# Altium project STM32WB55开发板.PrjPcb
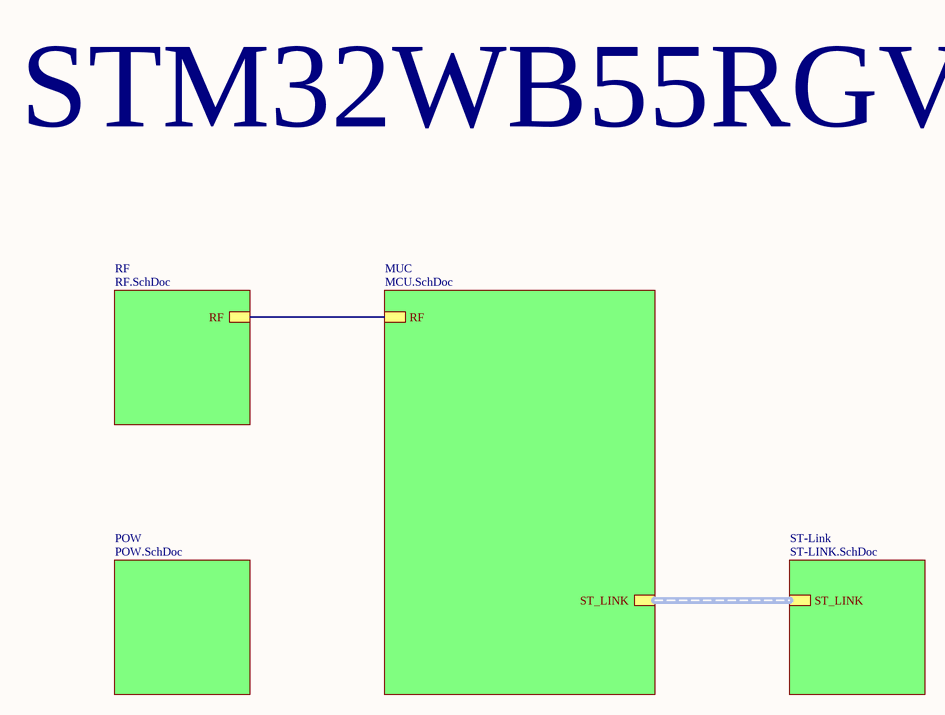
[diagram p0: WB55_Schematic.SchDoc]
5 sheets, 103 parts. Net scope: hierarchical (ports join the sheet entries above them; power ports are global).
Board file: PCB1.PcbDoc
Sheets:
  WB55_Schematic.SchDoc
    POW = POW.SchDoc
    MUC = MCU.SchDoc
    RF = RF.SchDoc
    ST-Link = ST-LINK.SchDoc

## Sheet WB55_Schematic.SchDoc
size A4; SheetNumber: 1; SheetTotal: 5

### Sub-sheets
MUC = MCU.SchDoc: RF, ST_LINK
POW = POW.SchDoc: no entries
RF = RF.SchDoc: RF
ST-Link = ST-LINK.SchDoc: ST_LINK

### Nets
RF1: sheet MUC/RF, sheet RF/RF

### Buses and harness runs
harness sheet MUC/ST_LINK = sheet ST-Link/ST_LINK

### Notes on the sheet
- STM32WB55RGV6

## Sheet POW.SchDoc
size A4; SheetNumber: 2; SheetTotal: 5
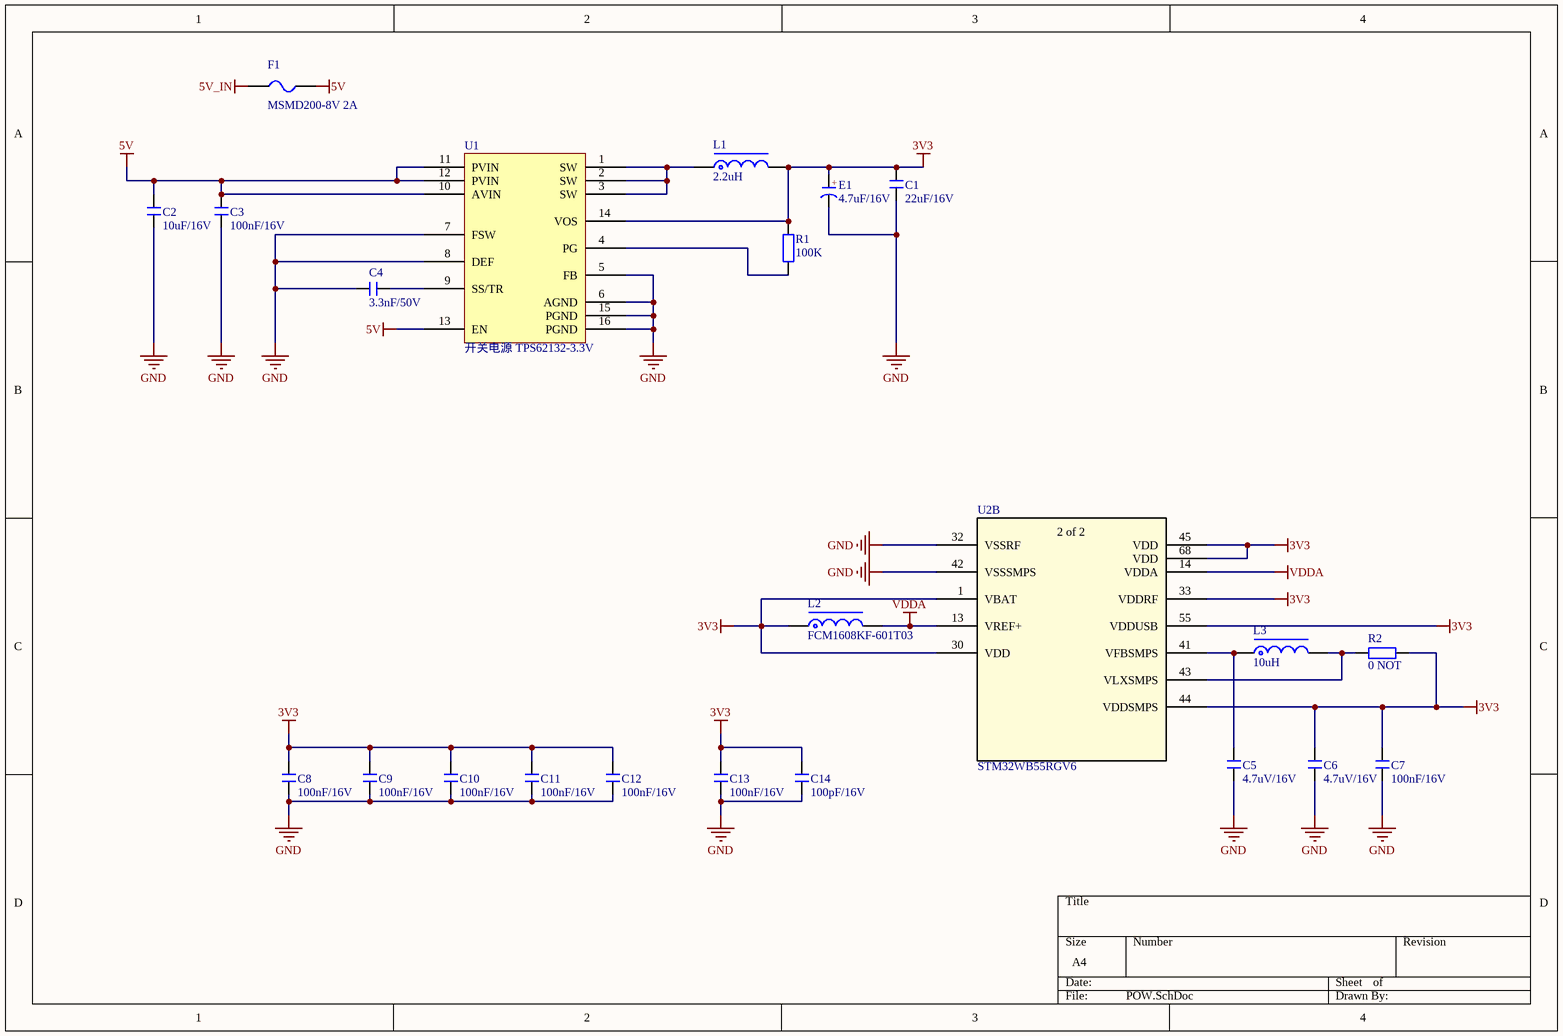
[diagram p1: POW.SchDoc]

### Parts
C1  22uF/16V  [C 0805_L]
C2  10uF/16V  [C 0603_L]
C3  100nF/16V  [C 0402_L]
C4  3.3nF/50V  [C 0402_L]
C5  4.7uV/16V  [C 0603_L]
C6  4.7uV/16V  [C 0603_L]
C7  100nF/16V  [C 0402_L]
C8  100nF/16V  [C 0402_L]
C9  100nF/16V  [C 0402_L]
C10  100nF/16V  [C 0402_L]
C11  100nF/16V  [C 0402_L]
C12  100nF/16V  [C 0402_L]
C13  100nF/16V  [C 0402_L]
C14  100pF/16V  [C 0402_L]
E1  4.7uF/16V  [CD A(3216)]
F1  MSMD200-8V 2A  [FU 0603]
L1  2.2uH  [电感XFL4020]
L2  FCM1608KF-601T03  [L 0402]
L3  10uH  [L 0805]
R1  100K  [R 0402_L]
R2  0 NOT  [R 0603_L]
U1  开关电源 TPS62132-3.3V  [QFN16]
U2  STM32WB55RGV6  [VFQFN68-8x8mm-M]  (part B of 2)

### Nets
3V3: C1.1 C6.2 C7.2 C8.2 C9.2 C10.2 C11.2 C12.2 C13.2 C14.2 E1.1(A) L1.2 L2.1 R1.2 R2.1 U1.14(VOS) U2.1(VBAT) U2.30(VDD) U2.33(VDDRF) U2.44(VDDSMPS) U2.45(VDD) U2.55(VDDUSB) U2.68(VDD)
5V: C2.2 C3.2 F1.2 U1.10(AVIN) U1.11(PVIN) U1.12(PVIN) U1.13(EN)
5V_IN: F1.1
GND: C1.2 C2.1 C3.1 C4.1 C5.1 C6.1 C7.1 C8.1 C9.1 C10.1 C11.1 C12.1 C13.1 C14.1 E1.2(K) U1.5(FB) U1.6(AGND) U1.7(FSW) U1.8(DEF) U1.15(PGND) U1.16(PGND) U2.32(VSSRF) U2.42(VSSSMPS)
VDDA: L2.2 U2.13(VREF+) U2.14(VDDA)
NetC4_2: C4.2 U1.9(SS/TR)
NetC5_2: C5.2 L3.1 U2.41(VFBSMPS)
NetL1_1: L1.1 U1.1(SW) U1.2(SW) U1.3(SW)
NetL3_2: L3.2 R2.2 U2.43(VLXSMPS)
NetR1_1: R1.1 U1.4(PG)

### Notes on the sheet
- (in symbol C-CD) +
- (in symbol STM32WB55RGV6, part B) 2 of 2

### Library data of the parts
C1 = C: 贴片电容; 主类型: 电容; 值精度: ±10%; 元件封装: 0805; 具体类型: 陶瓷电容; 封装类型: 贴片; 温度漂移: X7R（10%）; 温度范围: -55°C ~ 125°C; 生产商: SAMSUNG(三星); 生产商零件编码: CL21A226KOQNNNE; 值/型号: 22uF/16V; 立创编号: C296720
C2 = C: 贴片电容; 主类型: 电容; 值精度: ±10%; 元件封装: 0603; 具体类型: 陶瓷电容; 封装类型: 贴片; 温度漂移: X5R; 温度范围: -55°C ~ 125°C; 生产商: SAMSUNG(三星); 生产商零件编码: CL10A106MO8NQNC; 值/型号: 10uF/16V; 立创编号: C92487C70462
C3 C7-C13 = C: 贴片电容; 主类型: 电容; 值精度: ±10%; 元件封装: 0402; 具体类型: 陶瓷电容; 封装类型: 贴片; 温度漂移: X7R（15%）; 温度范围: -55°C ~ 125°C; 生产商: YAGEO(国巨); 生产商零件编码: CC0402KRX7R7BB104; 值/型号: 100nF/16V; 立创编号: C60474
C4 = C: 贴片电容; 主类型: 电容; 值精度: ±5%; 元件封装: 0402; 具体类型: 陶瓷电容; 封装类型: 贴片; 温度漂移: X7R（5%）; 温度范围: -55°C ~ 125°C; 生产商: YAGEO(国巨); 生产商零件编码: CC0402JRX7R9BB332; 值/型号: 3.3nF/50V; 立创编号: C541447
C5 C6 = C: 贴片电容; 主类型: 电容; 值/型号: 4.7uF/16V; 值精度: ±10%; 元件封装: 0603; 具体类型: 陶瓷电容; 封装类型: 贴片; 温度漂移: X5R（10%）; 温度范围: -55°C ~ 125°C; 生产商: muRata(村田); 生产商零件编码: GRM188R61C475KE11D; 立创编号: C77045
C14 = C: 贴片电容; 主类型: 电容; 值精度: ±5%; 元件封装: 0402; 具体类型: 陶瓷电容; 封装类型: 贴片; 温度漂移: NP0（5%）; 温度范围: -55°C ~ 125°C; 生产商: YAGEO(国巨); 生产商零件编码: CC0402JRNPO7BN101; 值/型号: 100pF/16V; 立创编号: C526991
E1 = C-CD: 聚合物电容 4.7uF/16V; 主类型: 电容; 值精度: ±20%; 元件封装: CASE-A_3216; 封装类型: 贴片; 温度范围: -55℃ ~ +105℃; 生产商: Sunlord(顺络); 生产商零件编码: TC211A475M016A; 值/型号: 4.7uF/16V; 具体类型: 聚合物电容; 立创编号: C136628
F1 = FU: 贴片保险丝
L1 = L-CD: XFL4020-222MEB; 主类型: 电感; 元件封装: 4020; 具体类型: 功率电感; 封装类型: 贴片; 温度范围: -40-125; 生产商: Coilcraft; 类型备注: 淘宝采购; 值/型号: XFL4020-222MEB; 生产商零件编码: XFL4020-222MEB; 立创编号: https://detail.tmall.com/item.htm?spm=a230r.1.14.16.717a6f292tX0SR&id=619184428761&ns=1&abbucket=12
L2 = L-CD: 0805; 主类型: 电感; 元件封装: 0603; 具体类型: 功率电感; 封装类型: 贴片; 温度范围: -40-125; 生产商: 台庆; 值/型号: FCM1608KF-601T03; 生产商零件编码: FCM1608KF-601T03; 立创编号: C141723
L3 = L-CD: 74479777310A; 主类型: 电感; 元件封装: 0805; 具体类型: 功率电感; 封装类型: 贴片; 温度范围: -40-125; 生产商: WE; 类型备注: 淘宝采购; 值/型号: 74479777310A; 生产商零件编码: 74479777310A
R1 = R: 贴片电阻 0402 1%; 主类型: 电阻; 元件封装: 0402; 封装类型: 贴片; 温度漂移: ±100ppm/℃; 生产商: 国巨; 生产商零件编码: RC0402FR-07100KL; 值/型号: 100K; 值精度: ±1%; 具体类型: 贴片电阻; 立创编号: C60491
R2 = R: 贴片电阻 0402 1%; 主类型: 电阻; 值/型号: 0; 值精度: ±5%; 元件封装: 0603; 封装类型: 贴片; 温度漂移: -200ppm/℃~400ppm/℃; 生产商: 华新科(Walsin); 生产商零件编码: WR06X000PTL; 具体类型: 贴片电阻; 立创编号: C132607
U1 = 开关电源 TPS62133: 主类型: 线性稳压器; 值/型号: TPS62133RGTR; 元件封装: VQFN-16; 具体类型: LDO; 封装类型: 贴片; 温度范围: -40-85; 生产商: TI(德州仪器); 生产商零件编码: TPS62133RGTR; 立创编号: C73973
U2 = STM32WB55RGV6: No Description Available; Vendor: STMicroelectronics; Built_By: EMA_UL_Team; SourceLibrary: Updates_to_database_2020-10-19; Manufacturer_Part_Number: STM32WB55RGV6; Copyright: Copyright (C) 2018 Accelerated Designs. All rights reserved; RefDes: RefDes; Type: DEV

## Sheet MCU.SchDoc
size A3; SheetNumber: 3; SheetTotal: 5
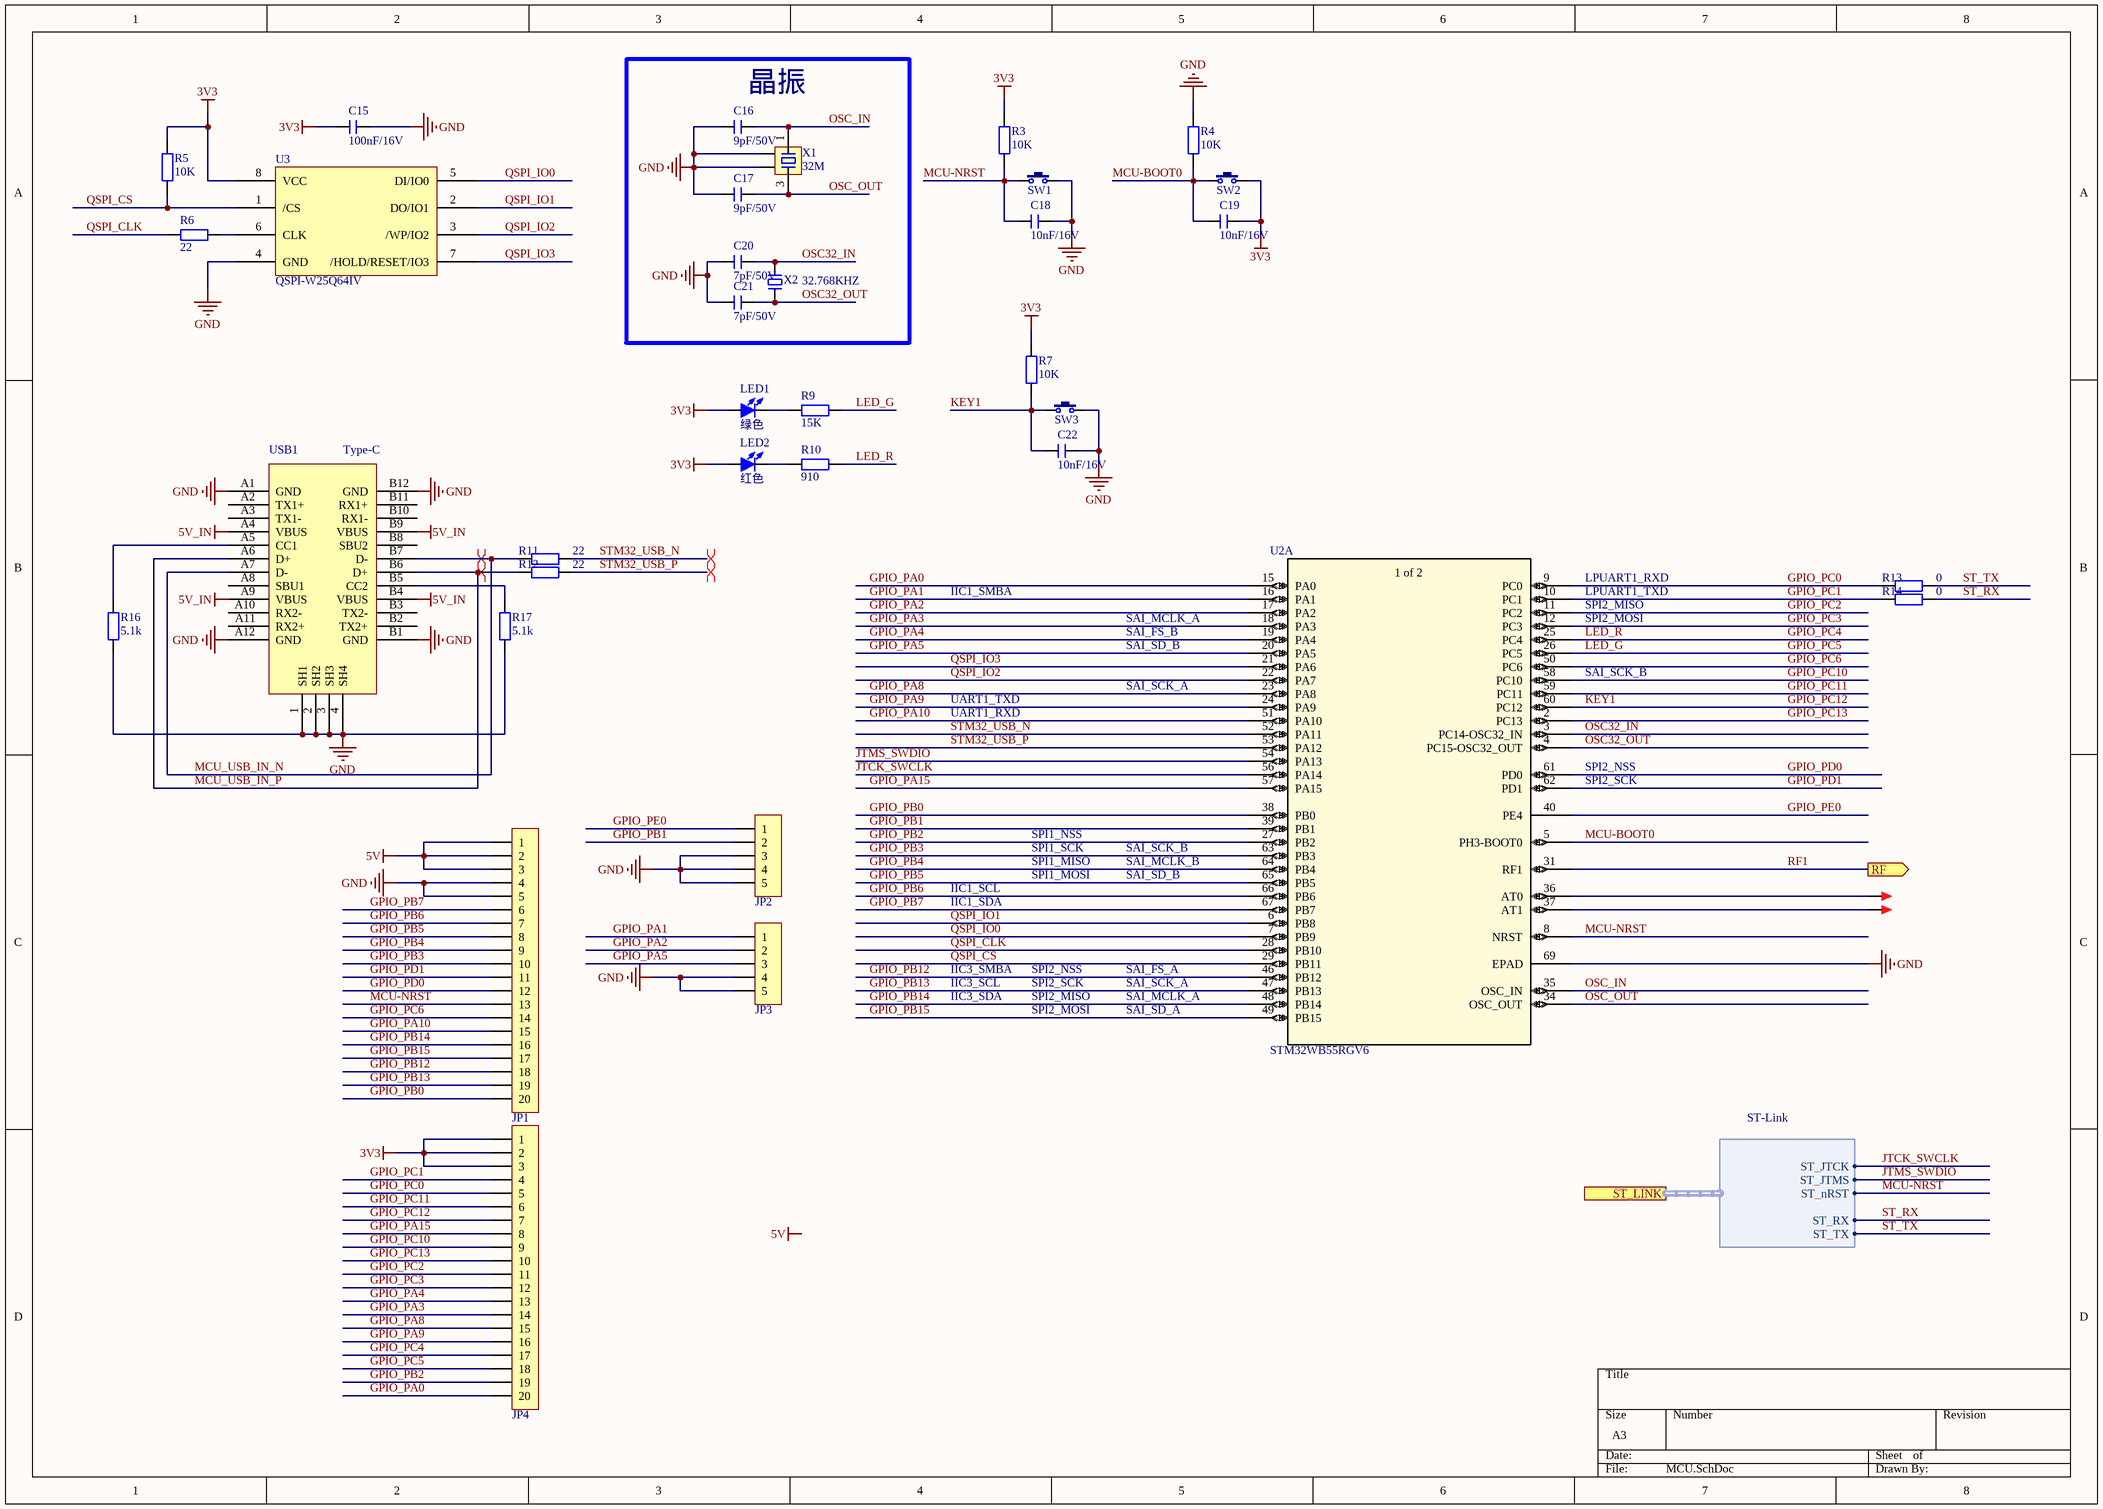
[diagram p2: MCU.SchDoc]

### Parts
C15  100nF/16V  [C 0402_L]
C16  9pF/50V  [C 0402_L]
C17  9pF/50V  [C 0402_L]
C18  10nF/16V  [C 0402_L]
C19  10nF/16V  [C 0402_L]
C20  7pF/50V  [C 0402_L]
C21  7pF/50V  [C 0402_L]
C22  10nF/16V  [C 0402_L]
JP1  HDR-1X20  [HDR2.54-LI-20P]  (value not drawn)
JP2  HDR-1X5  [HDR2.54-LI-5P]  (value not drawn)
JP3  HDR-1X5  [HDR2.54-LI-5P]  (value not drawn)
JP4  HDR-1X20  [HDR2.54-LI-20P]  (value not drawn)
LED1  绿色  [LED]
LED2  红色  [LED]
R3  10K  [R 0402_L]
R4  10K  [R 0402_L]
R5  10K  [R 0402_L]
R6  22  [R 0402_L]
R7  10K  [R 0402_L]
R9  15K  [R 0402_L]
R10  910  [R 0402_L]
R11  22  [R 0402_L]
R12  22  [R 0402_L]
R13  0  [R 0402_L]
R14  0  [R 0402_L]
R16  5.1k  [R 0402_L]
R17  5.1k  [R 0402_L]
SW1  3x6x5  [按钮]  (value not drawn)
SW2  3x6x5  [按钮]  (value not drawn)
SW3  3x6x5  [按钮]  (value not drawn)
TP1  TEST  [TEST 1.2]  (value not drawn)
TP2  TEST  [TEST 1.2]  (value not drawn)
U2  STM32WB55RGV6  [VFQFN68-8x8mm-M]  (part A of 2)
U3  QSPI-W25Q64IV  [QSPI]
USB1  Type-C  [Type-c接口]
X1  32M  [OSC 1612-4P]
X2  32.768KHZ  [OSC 3215-2P]

### Blocks framed on the sheet
晶振: C16 C17 C20 C21 X1 X2

### Ports
RF (out), ST_LINK (harness ST-Link)

### Harnesses
ST-Link: ST_JTCK, ST_JTMS, ST_nRST, ST_RX, ST_TX

### Nets
3V3: C15.2 C19.2 JP4.1 JP4.2 JP4.3 LED1.1(A) LED2.1(A) R3.2 R5.1 R7.2 SW2.2 U3.8(VCC)
5V: JP1.1 JP1.2 JP1.3
5V_IN: USB1.A4(VBUS) USB1.A9(VBUS) USB1.B4(VBUS) USB1.B9(VBUS)
GND: C15.1 C16.1 C17.1 C18.2 C20.1 C21.1 C22.2 JP1.4 JP1.5 JP2.3 JP2.4 JP2.5 JP3.4 JP3.5 R4.2 R16.2 R17.2 SW1.2 SW3.2 U2.69(EPAD) U3.4(GND) USB1.1(SH1) USB1.2(SH2) USB1.3(SH3) USB1.4(SH4) USB1.A1(GND) USB1.A12(GND) USB1.B1(GND) USB1.B12(GND) X1.2 X1.4
GPIO_PA0: JP4.20 U2.15(PA0)
GPIO_PA1: JP3.1 U2.16(PA1)
GPIO_PA2: JP3.2 U2.17(PA2)
GPIO_PA3: JP4.14 U2.18(PA3)
GPIO_PA4: JP4.13 U2.19(PA4)
GPIO_PA5: JP3.3 U2.20(PA5)
GPIO_PA8: JP4.15 U2.23(PA8)
GPIO_PA9: JP4.16 U2.24(PA9)
GPIO_PA10: JP1.15 U2.51(PA10)
GPIO_PA15: JP4.8 U2.57(PA15)
GPIO_PB0: JP1.20 U2.38(PB0)
GPIO_PB1: JP2.2 U2.39(PB1)
GPIO_PB2: JP4.19 U2.27(PB2)
GPIO_PB3: JP1.10 U2.63(PB3)
GPIO_PB4: JP1.9 U2.64(PB4)
GPIO_PB5: JP1.8 U2.65(PB5)
GPIO_PB6: JP1.7 U2.66(PB6)
GPIO_PB7: JP1.6 U2.67(PB7)
GPIO_PB12: JP1.18 U2.46(PB12)
GPIO_PB13: JP1.19 U2.47(PB13)
GPIO_PB14: JP1.16 U2.48(PB14)
GPIO_PB15: JP1.17 U2.49(PB15)
GPIO_PC0: JP4.5 R13.2 U2.9(PC0)
GPIO_PC1: JP4.4 R14.2 U2.10(PC1)
GPIO_PC2: JP4.11 U2.11(PC2)
GPIO_PC3: JP4.12 U2.12(PC3)
GPIO_PC4: JP4.17 R10.1 U2.25(PC4)  [also labelled LED_R]
GPIO_PC5: JP4.18 R9.1 U2.26(PC5)  [also labelled LED_G]
GPIO_PC6: JP1.14 U2.50(PC6)
GPIO_PC10: JP4.9 U2.58(PC10)
GPIO_PC11: JP4.6 U2.59(PC11)
GPIO_PC12: C22.1 JP4.7 R7.1 SW3.1 U2.60(PC12)  [also labelled KEY1]
GPIO_PC13: JP4.10 U2.2(PC13)
GPIO_PD0: JP1.12 U2.61(PD0)
GPIO_PD1: JP1.11 U2.62(PD1)
GPIO_PE0: JP2.1 U2.40(PE4)
JTCK_SWCLK: U2.56(PA14) ; port ST_LINK.ST_JTCK  [project net JTCK]
JTMS_SWDIO: U2.54(PA13) ; port ST_LINK.ST_JTMS  [project net JTMS]
MCU-BOOT0: C19.1 R4.1 SW2.1 U2.5(PH3-BOOT0)
MCU-NRST: C18.1 JP1.13 R3.1 SW1.1 U2.8(NRST) ; port ST_LINK.ST_nRST
MCU_USB_IN_N: R11.2 USB1.A7(D-) USB1.B7(D-)
MCU_USB_IN_P: R12.2 USB1.A6(D+) USB1.B6(D+)
OSC32_IN: C20.2 U2.3(PC14-OSC32_IN) X2.2
OSC32_OUT: C21.2 U2.4(PC15-OSC32_OUT) X2.1
OSC_IN: C16.2 U2.35(OSC_IN) X1.1
OSC_OUT: C17.2 U2.34(OSC_OUT) X1.3
QSPI_CLK: R6.1 U2.28(PB10)
QSPI_CS: R5.2 U2.29(PB11) U3.1(/CS)
QSPI_IO0: U2.7(PB9) U3.5(DI/IO0)
QSPI_IO1: U2.6(PB8) U3.2(DO/IO1)
QSPI_IO2: U2.22(PA7) U3.3(/WP/IO2)
QSPI_IO3: U2.21(PA6) U3.7(/HOLD/RESET/IO3)
RF1: U2.31(RF1) ; port RF
ST_RX: R14.1 ; port ST_LINK.ST_RX
ST_TX: R13.1 ; port ST_LINK.ST_TX
STM32_USB_N: R11.1 U2.52(PA11)
STM32_USB_P: R12.1 U2.53(PA12)
NetLED1_2: LED1.2(K) R9.2
NetLED2_2: LED2.2(K) R10.2
NetR6_2: R6.2 U3.6(CLK)
NetR16_1: R16.1 USB1.A5(CC1)
NetR17_1: R17.1 USB1.B5(CC2)
NetTP1_1: TP1.1 U2.36(AT0)
NetTP2_1: TP2.1 U2.37(AT1)

Not connected (* = marked no-connect by the designer): USB1 A2(TX1+) A3(TX1-) A8(SBU1) A10(RX2-) A11(RX2+) B2(TX2+) B3(TX2-) B8(SBU2) B10(RX1-) B11(RX1+)

### Layout directives
differential pair: MCU_USB_IN_N, MCU_USB_IN_P, STM32_USB_N, STM32_USB_P

### Notes on the sheet
- LPUART1_RXD
- IIC1_SMBA
- SAI_FS_B
- SAI_SD_B
- SAI_MCLK_A
- LPUART1_TXD
- SPI2_MISO
- SPI2_MOSI
- UART1_TXD
- UART1_RXD
- SAI_SCK_A
- SAI_SCK_B
- SPI2_NSS
- SPI2_SCK
- SPI1_NSS
- SPI1_SCK
- IIC1_SCL
- IIC1_SDA
- SPI1_MISO
- SPI1_MOSI
- SAI_MCLK_B
- IIC3_SMBA
- IIC3_SCL
- SAI_FS_A
- IIC3_SDA
- SAI_SD_A
- Labels drawn without touching a wire or pin: 5V
- (in symbol STM32WB55RGV6, part A) 1 of 2

### Library data of the parts
C15 = C: as C3 on sheet POW; 值/型号: 100nF/16V; 立创编号: C60474
C16 C17 = C: 贴片电容; 主类型: 电容; 值/型号: 10pF/50V; 值精度: ±1%; 元件封装: 0402; 具体类型: 陶瓷电容; 封装类型: 贴片; 温度漂移: C0G; 生产商: FH(风华); 生产商零件编码: 0402CG100F500NT; 立创编号: C285132
C18 C19 C22 = C: 贴片电容; 主类型: 电容; 值精度: ±10%; 元件封装: 0402; 具体类型: 陶瓷电容; 封装类型: 贴片; 温度漂移: X7R; 生产商: YAGEO(国巨); 生产商零件编码: CC0402KRX7R7BB103; 值/型号: 10nF/16V; 立创编号: C327009
C20 C21 = C: 贴片电容; 主类型: 电容; 值精度: ±0.25pF; 元件封装: 0402; 具体类型: 陶瓷电容; 封装类型: 贴片; 温度漂移: C0G; 生产商: FH(风华); 生产商零件编码: 0402CG7R0C500NT; 值/型号: 7pF/50V; 立创编号: C1577
JP1 JP4 = Header 20: 20P接插件
JP2 JP3 = Header 5: 5P接插件
LED1 LED2 = LED-SMD: C84267
R3 R4 R7 = R: 贴片电阻; 主类型: 电阻; 值精度: 1%; 元件封装: 贴片; 温度漂移: ±100ppm/℃; 生产商: YAGEO（国巨）; 生产商零件编码: RC0402FR-0710KL; 值/型号: 10K; 具体类型: 贴片电阻; 封装类型: 贴片; 立创编号: C60490
R5 = R: 贴片电阻 0402 1%; 主类型: 电阻; 元件封装: 0402; 封装类型: 贴片; 温度漂移: ±100ppm/℃; 生产商: 国巨; 生产商零件编码: RC0402FR-0710KL; 值/型号: 10K; 值精度: ±1%; 具体类型: 贴片电阻; 立创编号: C60490
R6 = R: 贴片电阻 0402 1%; 主类型: 电阻; 元件封装: 0402; 封装类型: 贴片; 温度漂移: ±100ppm/℃; 生产商: 国巨; 生产商零件编码: RC0402FR-0722RL; 值/型号: 22; 值精度: ±1%; 具体类型: 贴片电阻; 立创编号: C114765
R9 = R: 贴片电阻 0402 5%; 主类型: 电阻; 值精度: ±1%; 元件封装: 0402; 封装类型: 贴片; 温度漂移: 50ppm; 生产商: 国巨; 生产商零件编码: RT0402FRE0715KL; 值/型号: 15K; 具体类型: 贴片电阻; 立创编号: C136975
R10 = R: 贴片电阻 0402 5%; 主类型: 电阻; 值精度: ±1%; 元件封装: 0402; 封装类型: 贴片; 温度漂移: 50ppm; 生产商: UNI-ROYAL(厚声); 生产商零件编码: 0402WGF9100TCE; 值/型号: 910; 具体类型: 贴片电阻; 立创编号: C44933
R11 R12 = R: 贴片电阻 0402 5%; 主类型: 电阻; 值精度: ±1%; 元件封装: 0402; 封装类型: 贴片; 温度漂移: 50ppm; 生产商: 国巨; 生产商零件编码: RC0402FR-0722RL; 值/型号: 22; 具体类型: 贴片电阻; 立创编号: C114765
R13 R14 = R: 贴片电阻 0402 5%; 主类型: 电阻; 元件封装: 0402; 封装类型: 贴片; 温度漂移: 50ppm; 生产商: 国巨; 生产商零件编码: RC0402JR-070RL; 值/型号: 0; 值精度: ±5%; 具体类型: 贴片电阻; 立创编号: C60485
R16 R17 = R: 贴片电阻 0402 5%; 主类型: 电阻; 值精度: ±1%; 元件封装: 0402; 封装类型: 贴片; 温度漂移: 50ppm; 生产商: 国巨; 生产商零件编码: RC0402FR-075K1L; 值/型号: 5.1K; 具体类型: 贴片电阻; 立创编号: C105872
SW1-SW3 = TSW 3x6: 3x6轻触开关
TP1 TP2 = TEST: 测试点
U2 = STM32WB55RGV6: as U2 on sheet POW; Manufacturer_Part_Number: STM32WB55RGV6; Copyright: Copyright (C) 2018 Accelerated Designs. All rights reserved; RefDes: RefDes; Type: DEV
U3 = QSPI-W25Q256IV
USB1 = USB-Type-C-TOP
X1 = XTAL-4P: 4脚无源晶振; 主类型: 晶振; 值精度: 9PPM; 元件封装: 1612; 具体类型: 无源晶振; 封装类型: 贴片; 温度范围: -40℃~85℃; 生产商: EPSON(爱普生); 生产商零件编码: X1E0002510050; 值/型号: 32M; 立创编号: C255987
X2 = XTAL-2P: 2脚无源脚晶振; 主类型: 晶振; 值精度: 10PPM; 元件封装: 3215; 具体类型: 无源晶振; 封装类型: 贴片; 温度范围: -40℃ ~ +85℃; 生产商: EPSON(爱普生); 生产商零件编码: Q13FC1350000200; 值/型号: 32.768K; 立创编号: C48615

## Sheet RF.SchDoc
size A4; SheetNumber: 4; SheetTotal: 5
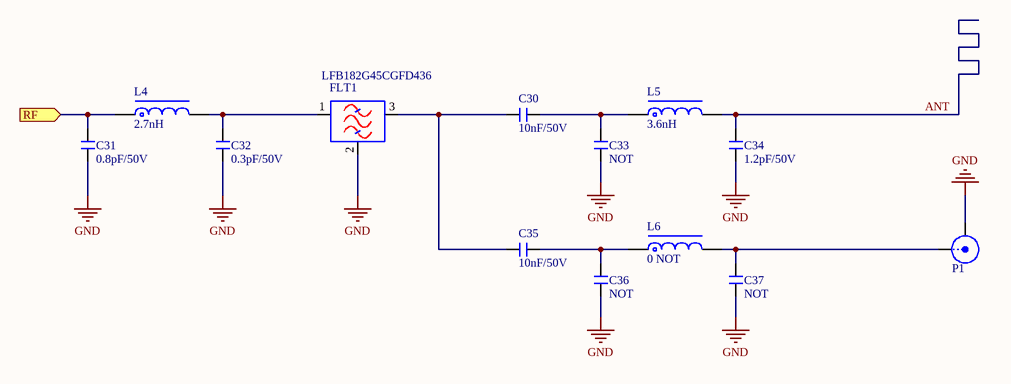
[diagram p3: RF.SchDoc]

### Parts
C30  10nF/50V  [C 0402_L]
C31  0.8pF/50V  [C 0402_L]
C32  0.3pF/50V  [C 0402_L]
C33  NOT  [C 0402_L]
C34  1.2pF/50V  [C 0402_L]
C35  10nF/50V  [C 0402_L]
C36  NOT  [C 0402_L]
C37  NOT  [C 0402_L]
FLT1  LFB182G45CGFD436  [LFB182G45CGFD436]
L4  2.7nH  [L 0402]
L5  3.6nH  [L 0402]
L6  0 NOT  [L 0402]
P1  SMB  [PCBComponent_1 - duplicate]  (value not drawn)

### Ports
RF (in)

### Nets
GND: C31.2 C32.2 C33.2 C34.2 C36.2 C37.2 FLT1.2(GND) P1.2(Y)
ANT: C34.1 L5.2
RF1: C31.1 L4.1 ; port RF
NetC30_1: C30.1 C35.1 FLT1.3(I/O)
NetC30_2: C30.2 C33.1 L5.1
NetC32_1: C32.1 FLT1.1(I/O) L4.2
NetC35_2: C35.2 C36.1 L6.1
NetC37_1: C37.1 L6.2 P1.1(X)

### Library data of the parts
C30 C35 = C: 贴片电容; 主类型: 电容; 值精度: ±5%; 元件封装: 0402; 具体类型: 陶瓷电容; 封装类型: 贴片; 温度漂移: X7R（10%）; 温度范围: -55°C ~ 125°C; 生产商: YAGEO(国巨); 生产商零件编码: CC0402JRX7R9BB103; 值/型号: 10nF/50V; 立创编号: C272878
C31 = C: 贴片电容; 主类型: 电容; 值精度: ±0.05pF; 元件封装: 0402; 具体类型: 陶瓷电容; 封装类型: 贴片; 温度漂移: X7R（10%）; 温度范围: -55°C ~ 125°C; 生产商: muRata(村田); 生产商零件编码: GJM1555C1HR80WB01D; 值/型号: 0.8pF/50V; 立创编号: C88902
C32 = C: 贴片电容; 主类型: 电容; 值精度: ±0.05pF; 元件封装: 0402; 具体类型: 陶瓷电容; 封装类型: 贴片; 温度漂移: X7R（10%）; 温度范围: -55°C ~ 125°C; 生产商: muRata(村田); 生产商零件编码: GJM1555C1HR30WB01D; 值/型号: 0.3pF/50V; 立创编号: C76909
C33 C36 C37 = C: 贴片电容; 主类型: 电容; 值/型号: 22uF/16V; 值精度: ±10%; 元件封装: 0805; 具体类型: 陶瓷电容; 封装类型: 贴片; 温度漂移: X7R（10%）; 温度范围: -55°C ~ 125°C; 生产商: SAMSUNG(三星); 生产商零件编码: CL21A226KOQNNNE; 立创编号: C296720
C34 = C: 贴片电容; 主类型: 电容; 值精度: ±0.05pF; 元件封装: 0402; 具体类型: 陶瓷电容; 封装类型: 贴片; 温度漂移: X7R（10%）; 温度范围: -55°C ~ 125°C; 生产商: muRata(村田); 生产商零件编码: GJM1555C1H1R2WB01D; 值/型号: 1.2pF/50V; 立创编号: C76899
FLT1 = LFB182G45CGFD436: Band Pass Filter Murata LFB182G45CGFD436; 主类型: 电感; 元件封装: 0603; 具体类型: 滤波电感; 封装类型: 贴片; 生产商: muRata(村田); 值/型号: LFB182G45CGFD436; 生产商零件编码: LFB182G45CGFD436
L4 = L-CD: LQG15HS2N7S02; 主类型: 电感; 元件封装: 0402; 具体类型: 贴片电感; 封装类型: 贴片; 温度范围: -40-125; 生产商: muRata(村田); 生产商零件编码: LQG15HS2N7S02D; 值/型号: LQG15HS2N7S02; 立创编号: C77108
L5 = L-CD: LQG15HS3N6S02; 主类型: 电感; 元件封装: 0402; 具体类型: 贴片电感; 封装类型: 贴片; 温度范围: -40-125; 生产商: muRata(村田); 生产商零件编码: LQG15HS3N6S02D; 值/型号: LQG15HS3N6S02; 立创编号: C19216
L6 = L-CD: 主类型: 电感; 元件封装: 4020; 具体类型: 功率电感; 封装类型: 贴片; 温度范围: -40-125; 生产商: Coilcraft; 生产商零件编码: XFL4020-222MEB; 类型备注: 淘宝采购; 立创编号: https://detail.tmall.com/item.htm?spm=a230r.1.14.16.717a6f292tX0SR&id=619184428761&ns=1&abbucket=12
P1 = SMB: SMB Straight Connector

## Sheet ST-LINK.SchDoc
size A4; SheetNumber: 5; SheetTotal: 5
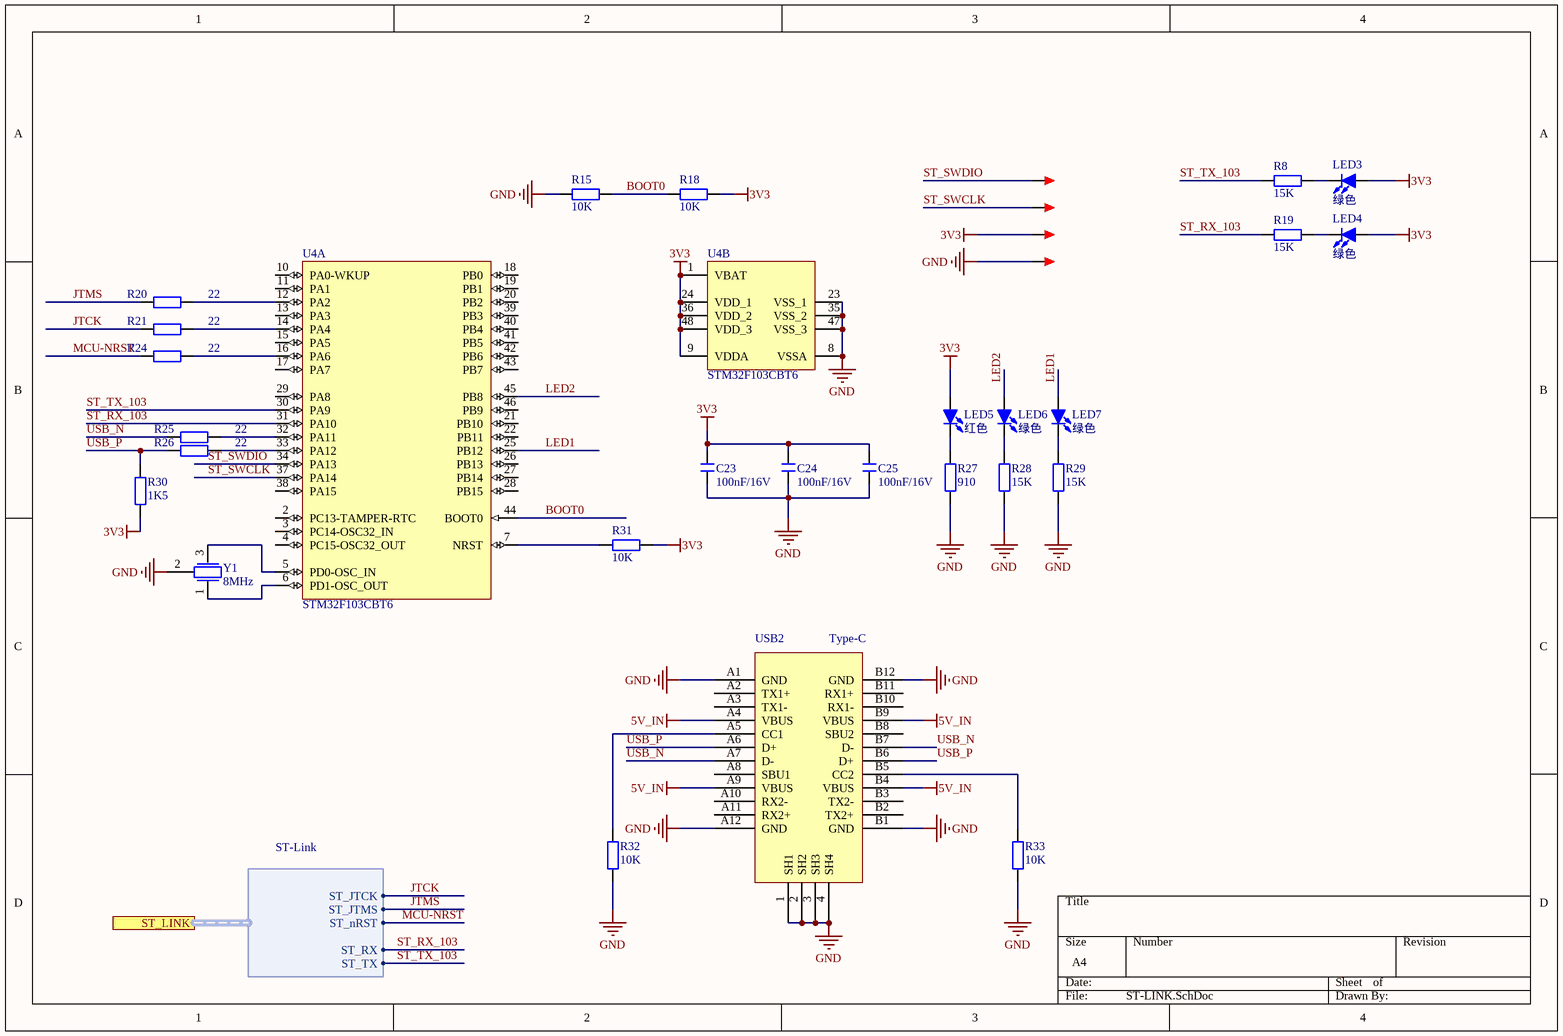
[diagram p4: ST-LINK.SchDoc]

### Parts
C23  100nF/16V  [C 0402_L]
C24  100nF/16V  [C 0402_L]
C25  100nF/16V  [C 0402_L]
LED3  绿色  [LED]
LED4  绿色  [LED]
LED5  红色  [LED]
LED6  绿色  [LED]
LED7  绿色  [LED]
R8  15K  [R 0402_L]
R15  10K  [R 0402_L]
R18  10K  [R 0402_L]
R19  15K  [R 0402_L]
R20  22  [R 0402_L]
R21  22  [R 0402_L]
R24  22  [R 0402_L]
R25  22  [R 0402_L]
R26  22  [R 0402_L]
R27  910  [R 0402_L]
R28  15K  [R 0402_L]
R29  15K  [R 0402_L]
R30  1K5  [R 0402_L]
R31  10K  [R 0402_L]
R32  10K  [R 0402_L]
R33  10K  [R 0402_L]
TP3  TEST  [TEST 1.2]  (value not drawn)
TP4  TEST  [TEST 1.2]  (value not drawn)
TP5  TEST  [TEST 1.2]  (value not drawn)
TP6  TEST  [TEST 1.2]  (value not drawn)
U4  STM32F103CBT6  [LQFP48 7X7_N]  (parts A,B of 2)
USB2  Type-C  [Type-c接口]
Y1  8MHz  [三脚晶振]

### Ports
ST_LINK (harness ST-Link)

### Harnesses
ST-Link: ST_JTCK, ST_JTMS, ST_nRST, ST_RX, ST_TX

### Nets
3V3: C23.2 C24.2 C25.2 LED3.1(A) LED4.1(A) LED5.1(A) R18.1 R30.2 R31.1 TP5.1 U4.1(VBAT) U4.9(VDDA) U4.24(VDD_1) U4.36(VDD_2) U4.48(VDD_3)
5V_IN: USB2.A4(VBUS) USB2.A9(VBUS) USB2.B4(VBUS) USB2.B9(VBUS)
GND: C23.1 C24.1 C25.1 R15.1 R27.1 R28.1 R29.1 R32.1 R33.1 TP6.1 U4.8(VSSA) U4.23(VSS_1) U4.35(VSS_2) U4.47(VSS_3) USB2.1(SH1) USB2.2(SH2) USB2.3(SH3) USB2.4(SH4) USB2.A1(GND) USB2.A12(GND) USB2.B1(GND) USB2.B12(GND) Y1.2
BOOT0: R15.2 R18.2 U4.44(BOOT0)
JTCK: R21.2 ; port ST_LINK.ST_JTCK
JTMS: R20.2 ; port ST_LINK.ST_JTMS
LED1: LED7.1(A) U4.25(PB12)
LED2: LED6.1(A) U4.45(PB8)
MCU-NRST: R24.2 ; port ST_LINK.ST_nRST
ST_RX_103: R19.1 U4.31(PA10) ; port ST_LINK.ST_RX  [project net ST_RX]
ST_SWCLK: TP4.1 U4.37(PA14)
ST_SWDIO: TP3.1 U4.34(PA13)
ST_TX_103: R8.1 U4.30(PA9) ; port ST_LINK.ST_TX  [project net ST_TX]
USB_N: R25.2 USB2.A7(D-) USB2.B7(D-)
USB_P: R26.2 R30.1 USB2.A6(D+) USB2.B6(D+)
NetLED3_2: LED3.2(K) R8.2
NetLED4_2: LED4.2(K) R19.2
NetLED5_2: LED5.2(K) R27.2
NetLED6_2: LED6.2(K) R28.2
NetLED7_2: LED7.2(K) R29.2
NetR20_1: R20.1 U4.12(PA2)
NetR21_1: R21.1 U4.14(PA4)
NetR24_1: R24.1 U4.16(PA6)
NetR25_1: R25.1 U4.32(PA11)
NetR26_1: R26.1 U4.33(PA12)
NetR31_2: R31.2 U4.7(NRST)
NetR32_2: R32.2 USB2.A5(CC1)
NetR33_2: R33.2 USB2.B5(CC2)
NetU4_5: U4.5(PD0-OSC_IN) Y1.3
NetU4_6: U4.6(PD1-OSC_OUT) Y1.1

Not connected (* = marked no-connect by the designer): U4 2(PC13-TAMPER-RTC) 3(PC14-OSC32_IN) 4(PC15-OSC32_OUT) 10(PA0-WKUP) 11(PA1) 13(PA3) 15(PA5) 17(PA7) 18(PB0) 19(PB1) 20(PB2) 21(PB10) 22(PB11) 26(PB13) 27(PB14) 28(PB15) 29(PA8) 38(PA15) 39(PB3) 40(PB4) 41(PB5) 42(PB6) 43(PB7) 46(PB9); USB2 A2(TX1+) A3(TX1-) A8(SBU1) A10(RX2-) A11(RX2+) B2(TX2+) B3(TX2-) B8(SBU2) B10(RX1-) B11(RX1+)

### Library data of the parts
C23-C25 = C: as C3 on sheet POW; 值/型号: 100nF/16V; 立创编号: C60474
LED3-LED7 = LED-SMD: C84267
R8 R19 R28 R29 = R: as R9 on sheet MCU; 值/型号: 15K; 具体类型: 贴片电阻; 立创编号: C136975
R15 R18 R31-R33 = R: 贴片电阻; 主类型: 电阻; 值精度: ±1%; 元件封装: 0402; 封装类型: 贴片; 温度漂移: ±100ppm/℃; 生产商: YAGEO（国巨）; 生产商零件编码: RC0402FR-0710KL; 值/型号: 10K; 具体类型: 贴片电阻; 立创编号: C60490
R20 R21 R24-R26 = R: 贴片电阻; 主类型: 电阻; 值/型号: 10K; 值精度: ±1%; 元件封装: 0402; 封装类型: 贴片; 温度漂移: ±100ppm/℃; 生产商: YAGEO（国巨）; 生产商零件编码: RC0402FR-0710KL; 具体类型: 贴片电阻; 立创编号: C60490
R27 = R: as R10 on sheet MCU; 值/型号: 910; 具体类型: 贴片电阻; 立创编号: C44933
R30 = R: 贴片电阻; 主类型: 电阻; 值/型号: 1.5K; 值精度: ±1%; 元件封装: 0402; 封装类型: 贴片; 生产商: YAGEO(国巨); 生产商零件编码: RC0402FR-071K5L; 具体类型: 贴片电阻; 立创编号: C114759
TP3-TP6 = TEST: 测试点
U4 = STM32F103CBT6: ARM Cortex-M3 32-bit MCU, 128 KB Flash, 20 KB Internal RAM, 37 I/Os, 48-pin LQFP, -40 to 85 degC, Tray
USB2 = USB-Type-C-TOP
Y1 = 晶振-3Pin: 村田贴片

## Nets that join several sheets
3V3: POW (23 pins), MCU (12 pins), ST-LINK (15 pins)
5V: POW (7 pins), MCU (JP1.1 JP1.2 JP1.3)
5V_IN: POW (F1.1), MCU (USB1.A4 USB1.A9 USB1.B4 USB1.B9), ST-LINK (USB2.A4 USB2.A9 USB2.B4 USB2.B9)
GND: POW (23 pins), MCU (31 pins), RF (8 pins), ST-LINK (23 pins)
JTCK: MCU (U2.56), ST-LINK (R21.2)
JTMS: MCU (U2.54), ST-LINK (R20.2)
MCU-NRST: MCU (5 pins), ST-LINK (R24.2)
RF1: MCU (U2.31), RF (C31.1 L4.1)
ST_RX: MCU (R14.1), ST-LINK (R19.1 U4.31)
ST_TX: MCU (R13.1), ST-LINK (R8.1 U4.30)